# Altium schematic sheet MPU6500.SchDoc
size A4; SheetNumber: 7; SheetTotal: 7
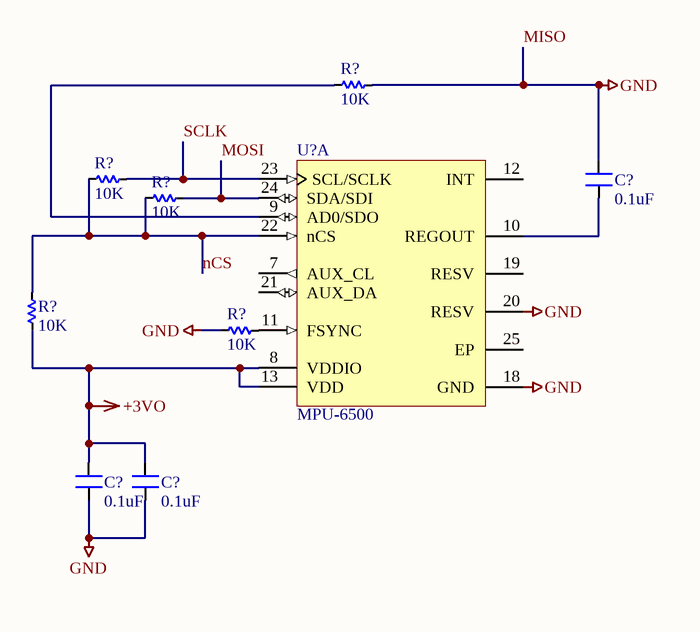
[diagram p0: MPU6500.SchDoc]

## Parts
(Parts that share a designator on the sheet are numbered #1, #2 ... from top to bottom, then left to right.)
C?#1  0.1uF  [C-SE-7,5x10x9x5x4]
C?#2  0.1uF  [C-SE-7,5x10x9x5x4]
C?#3  0.1uF  [C-SE-7,5x10x9x5x4]
R?#1  10K  [RES-1/2W]
R?#2  10K  [RES-1/2W]
R?#3  10K  [RES-1/2W]
R?#4  10K  [RES-1/2W]
R?#5  10K  [RES-1/2W]
U?  MPU-6500  [INSE-MPU-6500-QFN24_N]  (part A of 2)

## Nets
+3VO: C?#2.2 C?#3.2 R?#4.2 U?.8(VDDIO) U?.13(VDD)
MISO: C?#1.2 C?#2.1 C?#3.1 R?#1.2 R?#5.2 U?.18(GND) U?.20(RESV)  [also labelled GND]
MOSI: R?#3.2 U?.24(SDA/SDI)
nCS: R?#2.1 R?#3.1 R?#4.1 U?.22(nCS)
SCLK: R?#2.2 U?.23(SCL/SCLK)
NetC?#1_1: C?#1.1 U?.10(REGOUT)
NetR?#1_1: R?#1.1 U?.9(AD0/SDO)
NetR?#5_1: R?#5.1 U?.11(FSYNC)

Not connected (* = marked no-connect by the designer): U? 7(AUX_CL) 12(INT) 19(RESV) 21(AUX_DA) 25(EP)

## Library data of the parts
C?#1-C?#3 = CN-SEMI-DIP: Capacitor (Semiconductor SIM Model); Value: 104; LatestRevisionDate: 17-Jul-2002; LatestRevisionNote: Re-released for DXP Platform.; PackageReference: C1206; Publisher: Altium Limited
R?#1-R?#5 = Res: Manufacturer: Generic Components; Class: Passive; SubClass: R; Published: 08/06/2000; Publisher: Altium Hobart Technology Centre
U? = CMP-2000-05154-1: 3-Axis Gyroscope and 3-Axis Accelerometer Motion Processing Unit with I2C and SPI, 1.71 to 3.45 V, -40 to 85 degC, 24-Pin QFN, RoHS, Tape and Reel; Manufacturer: InvenSense; Online Catalog: MPU-6500Series; Output Type: Digital; Sensor Type: GyroscopeandAccelerometer; Featured Product: InvenSense-MPU-6500Six-Axis(Gyro+Acceleromete)MEMSMotionTrackingDevices; Other Names: 1428-1011-6; Article Library: MCUsasSensorHubs; Series: -; Category: Sensors,Transducers; Dynamic Catalog: MPU-6500Series; Standard Package: 1; Manufacturer URL: http://www.invensense.com/; Family: Multifunction; Datasheet Version: Rev. 1.0, 09/2013; Datasheet URL: https://datasheet.ciiva.com/29175/mpu-6500-spec-29175093.pdf